# Altium schematic sheet mini.SchDoc
size A2
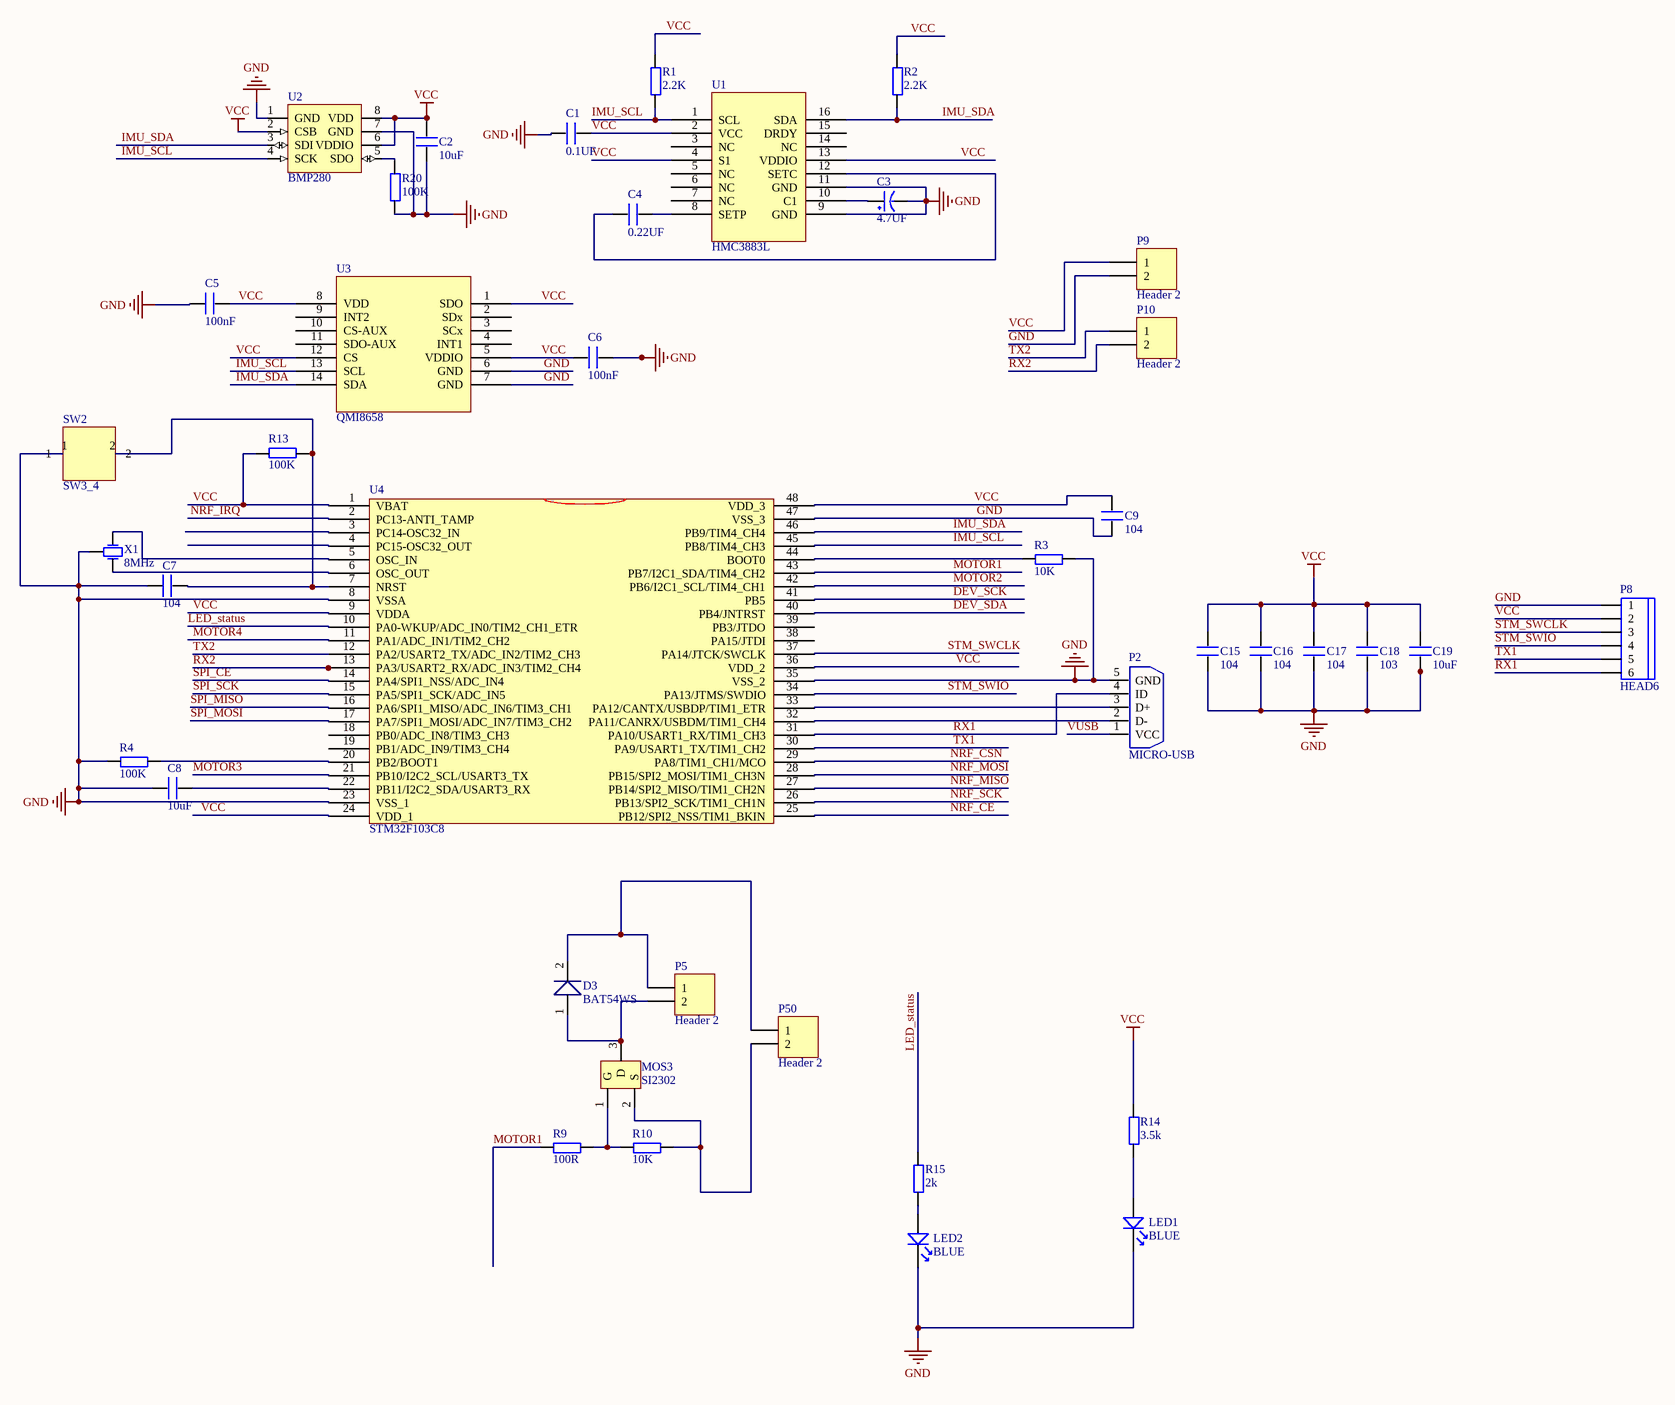
[diagram p0: mini.SchDoc]

## Parts
C1  0.1UF  [0603P]
C2  10uF  [0603P]
C3  4.7UF  [C0805 钽电容]
C4  0.22UF  [0603P]
C5  100nF  [0603P]
C6  100nF  [0603P]
C7  104  [0603P]
C8  10uF  [0603P]
C9  104  [0603P]
C15  104  [0603P]
C16  104  [0603P]
C17  104  [0603P]
C18  103  [0603P]
C19  10uF  [0603P]
D3  BAT54WS  [SOD-323]
LED1  BLUE  [0603]
LED2  BLUE  [0603]
MOS3  SI2302  [SO-G3/C2.5]
P2  MICRO-USB  [MICRO_USB5P_SOP]
P5  Header 2  [HDR1X2]
P8  HEAD6  [SH1.0-6P]
P9  Header 2  [HDR1X2]
P10  Header 2  [HDR1X2]
P50  Header 2  [HDR1X2]
R1  2.2K  [0603P]
R2  2.2K  [0603P]
R3  10K  [0603P]
R4  100K  [0603P]
R9  100R  [0603P]
R10  10K  [0603P]
R13  100K  [0603P]
R14  3.5k  [0603P]
R15  2k  [0603P]
R20  100K  [0603P]
SW2  SW3_4  [SW3_4]
U1  HMC3883L  [QFN-16PIN]
U2  BMP280  [LGA-8]
U3  QMI8658  [14pinLGA]
U4  STM32F103C8  [mTQFP48]
X1  8MHz  [XTAL3215]

## Nets
GND: C1.1 C2.1 C3.2(GND) C5.1 C6.2 C7.1 C8.1 C9.1 C15.1 C16.1 C17.1 C18.1 C19.1 LED1.2 LED2.2 P2.5(GND) P8.1 P9.2 R3.2 R4.1 R20.1 SW2.1 U1.9(GND) U1.11(GND) U2.1(GND) U2.7(GND) U3.6(GND) U3.7(GND) U4.8(VSSA) U4.23(VSS_1) U4.35(VSS_2) U4.47(VSS_3) X1.2(GND)
VCC: C1.2 C2.2 C5.2 C6.1 C9.2 C15.2 C16.2 C17.2 C18.2 C19.2 P8.2 P9.1 R1.2 R2.2 R13.2 R14.2 U1.2(VCC) U1.4(S1) U1.13(VDDIO) U2.2(CSB) U2.6(VDDIO) U2.8(VDD) U3.1(SDO) U3.5(VDDIO) U3.8(VDD) U3.12(CS) U4.1(VBAT) U4.9(VDDA) U4.24(VDD_1) U4.36(VDD_2) U4.48(VDD_3)
DEV_SCK: U4.41(PB5)
DEV_SDA: U4.40(PB4/JNTRST)
IMU_SCL: R1.1 U1.1(SCL) U2.4(SCK) U3.13(SCL) U4.45(PB8/TIM4_CH3)
IMU_SDA: R2.1 U1.16(SDA) U2.3(SDI) U3.14(SDA) U4.46(PB9/TIM4_CH4)
LED_status: R15.2 U4.10(PA0-WKUP/ADC_IN0/TIM2_CH1_ETR)
MOTOR1: R9.1 U4.43(PB7/I2C1_SDA/TIM4_CH2)
MOTOR2: U4.42(PB6/I2C1_SCL/TIM4_CH1)
MOTOR3: U4.21(PB10/I2C2_SCL/USART3_TX)
MOTOR4: U4.11(PA1/ADC_IN1/TIM2_CH2)
NRF_CE: U4.25(PB12/SPI2_NSS/TIM1_BKIN)
NRF_CSN: U4.29(PA8/TIM1_CH1/MCO)
NRF_IRQ: U4.2(PC13-ANTI_TAMP)
NRF_MISO: U4.27(PB14/SPI2_MISO/TIM1_CH2N)
NRF_MOSI: U4.28(PB15/SPI2_MOSI/TIM1_CH3N)
NRF_SCK: U4.26(PB13/SPI2_SCK/TIM1_CH1N)
RX1: P2.4(ID) P8.6 U4.31(PA10/USART1_RX/TIM1_CH3)
RX2: P10.2 U4.13(PA3/USART2_RX/ADC_IN3/TIM2_CH4)
SPI_CE: U4.14(PA4/SPI1_NSS/ADC_IN4)
SPI_MISO: U4.16(PA6/SPI1_MISO/ADC_IN6/TIM3_CH1)
SPI_MOSI: U4.17(PA7/SPI1_MOSI/ADC_IN7/TIM3_CH2)
SPI_SCK: U4.15(PA5/SPI1_SCK/ADC_IN5)
STM_SWCLK: P8.3 U4.37(PA14/JTCK/SWCLK)
STM_SWIO: P8.4 U4.34(PA13/JTMS/SWDIO)
TX1: P8.5 U4.30(PA9/USART1_TX/TIM1_CH2)
TX2: P10.1 U4.12(PA2/USART2_TX/ADC_IN2/TIM2_CH3)
VUSB: P2.1(VCC)
NetC3_1: C3.1(VCC) U1.10(C1)
NetC4_1: C4.1 U1.12(SETC)
NetC4_2: C4.2 U1.8(SETP)
NetC7_2: C7.2 R13.1 SW2.2 U4.7(NRST)
NetC8_2: C8.2 U4.22(PB11/I2C2_SDA/USART3_RX)
NetD3_1: D3.1 MOS3.3(D) P5.2
NetD3_2: D3.2 P5.1 P50.1
NetLED1_1: LED1.1 R14.1
NetLED2_1: LED2.1 R15.1
NetMOS3_1: MOS3.1(G) R9.2 R10.1
NetMOS3_2: MOS3.2(S) P50.2 R10.2
NetP2_2: P2.2(D-) U4.32(PA11/CANRX/USBDM/TIM1_CH4)
NetP2_3: P2.3(D+) U4.33(PA12/CANTX/USBDP/TIM1_ETR)
NetR3_1: R3.1 U4.44(BOOT0)
NetR4_2: R4.2 U4.20(PB2/BOOT1)
NetR20_2: R20.2 U2.5(SDO)
NetU4_5: U4.5(OSC_IN) X1.1(OSC1)
NetU4_6: U4.6(OSC_OUT) X1.3(OSC2)

Not connected (* = marked no-connect by the designer): U1 3(NC) 5(NC) 6(NC) 7(NC) 14(NC) 15(DRDY); U3 2(SDx) 3(SCx) 4(INT1) 9(INT2) 10(CS-AUX) 11(SDO-AUX); U4 3(PC14-OSC32_IN) 4(PC15-OSC32_OUT) 18(PB0/ADC_IN8/TIM3_CH3) 19(PB1/ADC_IN9/TIM3_CH4) 38(PA15/JTDI) 39(PB3/JTDO)

## Library data of the parts
C1 C2 C4-C9 C15-C19 = C
C3 = CAP
D3 = BAT54: 单肖特基二极管
LED1 LED2 = LED
MOS3 = MOS-N: AP2306
P2 = USB5
P5 P9 P10 P50 = Header 2: Header, 2-Pin; LatestRevisionDate: 17-Jul-2002; LatestRevisionNote: Re-released for DXP Platform.; Publisher: Altium Limited
R1-R4 R9 R10 R13-R15 R20 = R
SW2 = SW_3_4
U1 = HMC5883L
U4 = STM32F103C6
X1 = XTAL-3215